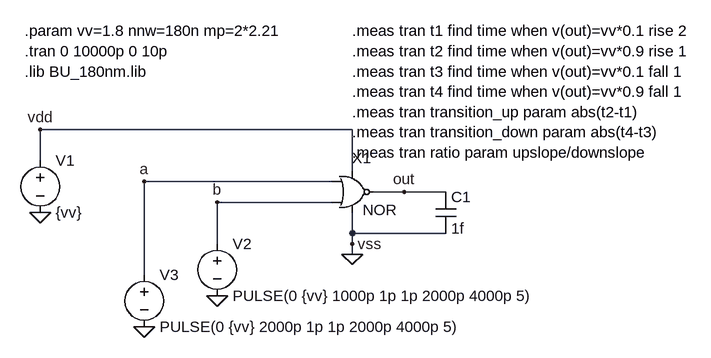
[diagram p0: schematic nor_test.asc]
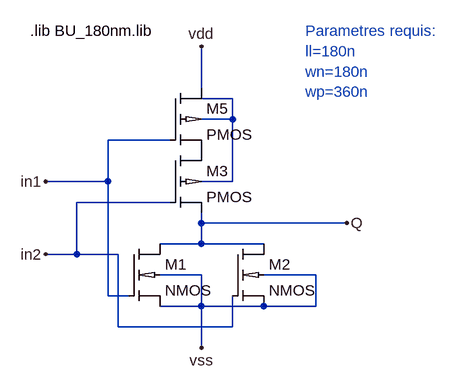
[diagram p1: sub-circuit nor.asc]
nor_test.asc, the LTspice schematic file:
Version 4
SHEET 1 1168 680
WIRE 416 224 -64 224
WIRE -64 272 -64 224
WIRE 416 288 416 224
WIRE 384 304 96 304
WIRE 496 320 448 320
WIRE 560 320 496 320
WIRE 384 336 208 336
WIRE 416 384 416 352
WIRE 560 384 416 384
WIRE 208 400 208 336
WIRE 416 400 416 384
WIRE 416 416 416 400
WIRE 96 448 96 304
FLAG -64 352 0
FLAG 208 480 0
FLAG 416 416 0
FLAG -64 224 vdd
FLAG 416 400 vss
FLAG 208 336 b
FLAG 496 320 out
FLAG 96 528 0
FLAG 96 304 a
SYMBOL /voltage -64 256 R0
SYMATTR InstName V1
SYMATTR Value {vv}
SYMBOL /voltage 208 384 R0
SYMATTR InstName V2
SYMATTR Value PULSE(0 {vv} 1000p 1p 1p 2000p 4000p 5)
SYMBOL /voltage 96 432 R0
SYMATTR InstName V3
SYMATTR Value PULSE(0 {vv} 2000p 1p 1p 2000p 4000p 5)
SYMBOL nor 416 320 R0
SYMATTR InstName X1
SYMATTR SpiceLine ll=180n wn={nnw} wp={nnw*mp}
SYMBOL cap 544 320 R0
SYMATTR InstName C1
SYMATTR Value 1f
TEXT -88 72 Left 2 !.param vv=1.8 nnw=180n mp=2*2.21\n.tran 0 10000p 0 10p\n.lib BU_180nm.lib
TEXT 416 72 Left 2 !.meas tran t1 find time when v(out)=vv*0.1 rise 2\n.meas tran t2 find time when v(out)=vv*0.9 rise 1\n.meas tran t3 find time when v(out)=vv*0.1 fall 1\n.meas tran t4 find time when v(out)=vv*0.9 fall 1\n.meas tran transition_up param abs(t2-t1)\n.meas tran transition_down param abs(t4-t3)\n.meas tran ratio param upslope/downslope

nor.asc, the sub-circuit schematic file:
Version 4
SHEET 1 1192 776
WIRE 416 288 416 224
WIRE 464 304 416 304
WIRE 464 336 464 304
WIRE 464 336 416 336
WIRE 368 368 272 368
WIRE 272 432 272 368
WIRE 272 432 176 432
WIRE 464 432 464 336
WIRE 464 432 416 432
WIRE 368 464 224 464
WIRE 416 496 416 480
WIRE 640 496 416 496
WIRE 416 528 416 496
WIRE 416 528 352 528
WIRE 512 528 416 528
WIRE 224 544 224 464
WIRE 224 544 176 544
WIRE 288 544 224 544
WIRE 416 576 352 576
WIRE 592 576 512 576
WIRE 272 608 272 432
WIRE 304 608 272 608
WIRE 416 624 416 576
WIRE 416 624 352 624
WIRE 512 624 416 624
WIRE 592 624 592 576
WIRE 592 624 512 624
WIRE 288 656 288 544
WIRE 464 656 464 608
WIRE 464 656 288 656
WIRE 416 688 416 624
FLAG 416 224 vdd
FLAG 416 688 vss
FLAG 640 496 Q
FLAG 176 432 in1
FLAG 176 544 in2
SYMBOL pmos018 368 288 R0
SYMATTR InstName M5
SYMATTR Value2 l={ll} w={wp} ad={450n*{wp}} as={450n*{wp}} pd={900n+{wp}} ps={1080n+{wp}}
SYMBOL nmos018 304 528 R0
SYMATTR InstName M1
SYMATTR Value2 l={ll} w={wn} ad={450n*{wn}} as={450n*{wn}} pd={900n+{wn}} ps={1080n+{wn}}
SYMBOL pmos018 368 384 R0
SYMATTR InstName M3
SYMATTR Value2 l={ll} w={wp} ad={450n*{wp}} as={450n*{wp}} pd={900n+{wp}} ps={1080n+{wp}}
SYMBOL nmos018 464 528 R0
SYMATTR InstName M2
SYMATTR Value2 l={ll} w={wn} ad={450n*{wn}} as={450n*{wn}} pd={900n+{wn}} ps={1080n+{wn}}
TEXT 152 200 Left 2 !.lib BU_180nm.lib
TEXT 576 200 Left 2 ;Parametres requis: \nll=180n \nwn=180n \nwp=360n

The netlist it stands for:
* nor_test.asc
V1 vdd 0 {vv}
V2 b 0 PULSE(0 {vv} 1000p 1p 1p 2000p 4000p 5)
V3 a 0 PULSE(0 {vv} 2000p 1p 1p 2000p 4000p 5)
XX1 a out vdd 0 b nor params: NOR ll=180n wn={nnw} wp={nnw*mp}
C1 out 0 1f

* block symbol definitions
.subckt nor in1 Q vdd vss in2
M5 vdd in1 P001 N001 PMOS l={ll} w={wp} ad={450n*{wp}} as={450n*{wp}} pd={900n+{wp}} ps={1080n+{wp}}
M1 Q in1 vss vss NMOS l={ll} w={wn} ad={450n*{wn}} as={450n*{wn}} pd={900n+{wn}} ps={1080n+{wn}}
M3 P001 in2 Q N001 PMOS l={ll} w={wp} ad={450n*{wp}} as={450n*{wp}} pd={900n+{wp}} ps={1080n+{wp}}
M2 Q in2 vss vss NMOS l={ll} w={wn} ad={450n*{wn}} as={450n*{wn}} pd={900n+{wn}} ps={1080n+{wn}}
.lib BU_180nm.lib
* Parametres requis:
* ll=180n
* wn=180n
* wp=360n
.ends nor

.model NMOS NMOS
.model PMOS PMOS
.lib standard.mos
.param vv=1.8 nnw=180n mp=2*2.21
.tran 0 10000p 0 10p
.lib BU_180nm.lib
.meas tran t1 find time when v(out)=vv*0.1 rise 2
.meas tran t2 find time when v(out)=vv*0.9 rise 1
.meas tran t3 find time when v(out)=vv*0.1 fall 1
.meas tran t4 find time when v(out)=vv*0.9 fall 1
.meas tran transition_up param abs(t2-t1)
.meas tran transition_down param abs(t4-t3)
.meas tran ratio param upslope/downslope
.lib BU_180nm.lib
.backanno
.end

* Results of the author's LTspice run, read from the files saved beside the schematic
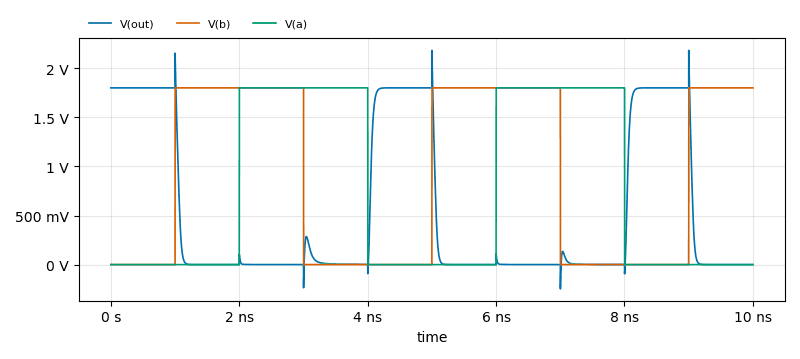
[diagram p2: Transient Analysis of nor_test.asc, plotted from the saved traces]
* Transient Analysis, 1 run:
*   V(out): min -246.5 mV, max 2.182 V, average 554.6 mV, rms 981.9 mV, last 2.317 µV
*   V(b): min 0 V, max 1.8 V, average 900.3 mV, rms 1.273 V, last 1.8 V
*   V(a): min 0 V, max 1.8 V, average 720.4 mV, rms 1.139 V, last 0 V
* From the log:
*   t1: time=4.01975e-009 at 4.01975e-009
*   t2: time=4.10123e-009 at 4.10123e-009
*   t3: time=1.10185e-009 at 1.10185e-009
*   t4: time=1.02028e-009 at 1.02028e-009
*   transition_up: abs(t2-t1)=8.14889e-011
*   transition_down: abs(t4-t3)=8.15753e-011
*   Measurement "ratio" FAIL'ed